# Altium schematic sheet LDO.SchDoc
size A; SheetNumber: 8; SheetTotal: 9
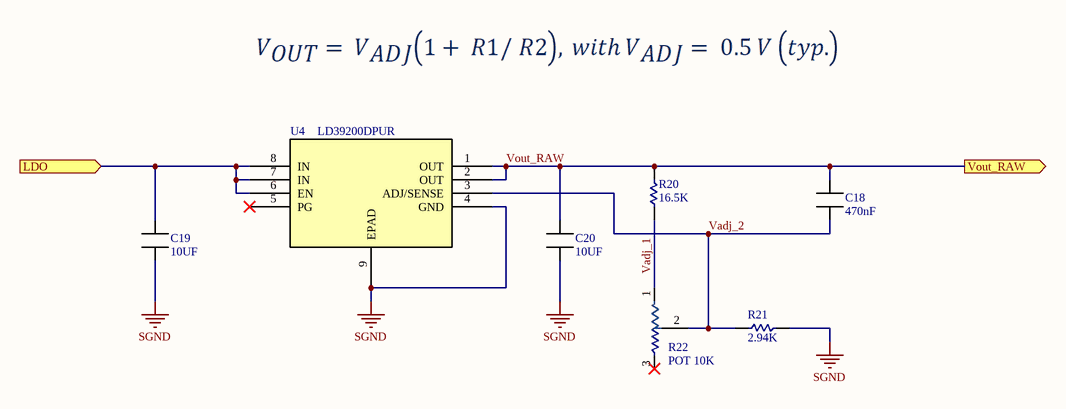
[diagram p0: LDO.SchDoc]

## Parts
C18  470nF  [Cap 0603]
C19  10UF  [Cap 0603]
C20  10UF  [Cap 0603]
R20  16.5K  [Res 0603]
R21  2.94K  [Res 0603]
R22  POT 10K  [3362P_1]
U4  LD39200DPUR  [DFN-8]

## Ports
LDO (in), Vout_RAW (out)

## Nets
SGND: C19.1 C20.1 R21.2(B) U4.4(GND) U4.9(EPAD)
LDO: C19.2 U4.6(EN) U4.7(IN) U4.8(IN) ; port LDO
Vadj_1: R20.1(A) R22.1(CCW)
Vadj_2: C18.1 R21.1(A) R22.2(WIPER) U4.3(ADJ/SENSE)
Vout_RAW: C18.2 C20.2 R20.2(B) U4.1(OUT) U4.2(OUT) ; port Vout_RAW

Not connected (* = marked no-connect by the designer): R22 3(CW)*; U4 5(PG)*

## Library data of the parts
C18 = CL10B474KO8NNND: Multilayer Ceramic Capacitors MLCC - SMD/SMT 470nF+/-10% 16V X7R 0603; Supplier 1: Mouser; Supplier Part Number 1: 187-CL10B474KO8NNND
C19 C20 = CL10A106KP8NNWC: Multilayer Ceramic Capacitors MLCC - SMD/SMT X5R, 10uF, +/-10%, 10v, 0603; Supplier 1: Mouser; Supplier Part Number 1: 187-CL10A106KP8NNWC
R20 = ERJ-PB3B1652V: Thick Film Resistors - SMD 0603 Anti-Surge Res. 0.1%, 16.5Koh; Supplier 1: Mouser; Supplier Part Number 1: 667-ERJ-PB3B1652V
R21 = RT0603BRD072K94L: Thin Film Resistors - SMD 0603 2.94Kohm 0.1% 25ppm; Supplier 1: Mouser; Supplier Part Number 1: 603-RT0603BRD072K94L
R22 = 3362H-1-103LF: Trimmer Resistors - Through Hole 1/4"SQ 10KOHMS 10% 0.5WATTS; Supplier 1: Mouser; Supplier Part Number 1: 652-3362H-1-103LF
U4 = LD39200DPUR: LDO Voltage Regulators 2 A high PSRR ultra low drop linear regulator reverse current protection; Supplier 1: Mouser; Supplier Part Number 1: 511-LD39200DPUR